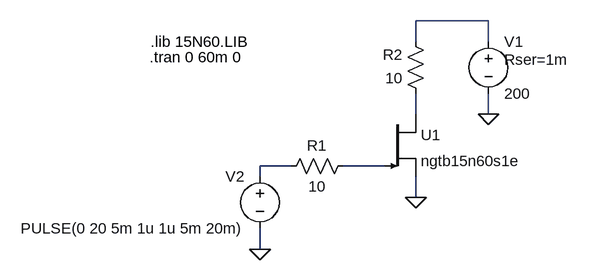
[diagram p0: schematic Draft1.asc]
Draft1.asc, the LTspice schematic file:
Version 4
SHEET 1 1212 680
WIRE 656 -208 544 -208
WIRE 544 -176 544 -208
WIRE 656 -176 656 -208
WIRE 544 -64 544 -96
WIRE 656 -64 656 -96
WIRE 352 16 304 16
WIRE 496 16 432 16
WIRE 304 32 304 16
WIRE 544 64 544 32
WIRE 304 144 304 112
FLAG 304 144 0
FLAG 656 -64 0
FLAG 544 64 0
SYMBOL voltage 304 16 M0
WINDOW 123 0 0 Left 2
WINDOW 39 0 0 Left 2
SYMATTR InstName V2
SYMATTR Value PULSE(0 20 5m 1u 1u 5m 20m)
SYMBOL Misc\\nigbt 496 -64 R0
SYMATTR InstName U1
SYMATTR Value ngtb15n60s1e
SYMBOL res 448 0 R90
WINDOW 0 0 56 VBottom 2
WINDOW 3 32 56 VTop 2
SYMATTR InstName R1
SYMATTR Value 10
SYMATTR SpiceLine tol=1 pwr=0.1
SYMBOL res 560 -80 R180
WINDOW 0 36 76 Left 2
WINDOW 3 36 40 Left 2
SYMATTR InstName R2
SYMATTR Value 10
SYMATTR SpiceLine tol=1 pwr=0.1
SYMBOL voltage 656 -192 R0
WINDOW 123 0 0 Left 2
WINDOW 39 24 44 Left 2
SYMATTR InstName V1
SYMATTR Value 200
SYMATTR SpiceLine Rser=1m
TEXT 136 -176 Left 2 !.lib 15N60.LIB
TEXT 134 -152 Left 2 !.tran 0 60m 0

The netlist it stands for:
* Draft1.asc
V2 N003 0 PULSE(0 20 5m 1u 1u 5m 20m)
Z§U1 N002 N004 0 ngtb15n60s1e
R1 N004 N003 10 tol=1 pwr=0.1
R2 N002 N001 10 tol=1 pwr=0.1
V1 N001 0 200 Rser=1m
.lib 15N60.LIB
.tran 0 60m 0
.backanno
.end